# Altium schematic sheet 1.8寸脱机4轴-原理图-V2.0-2022.05.13.SchDoc
size A3
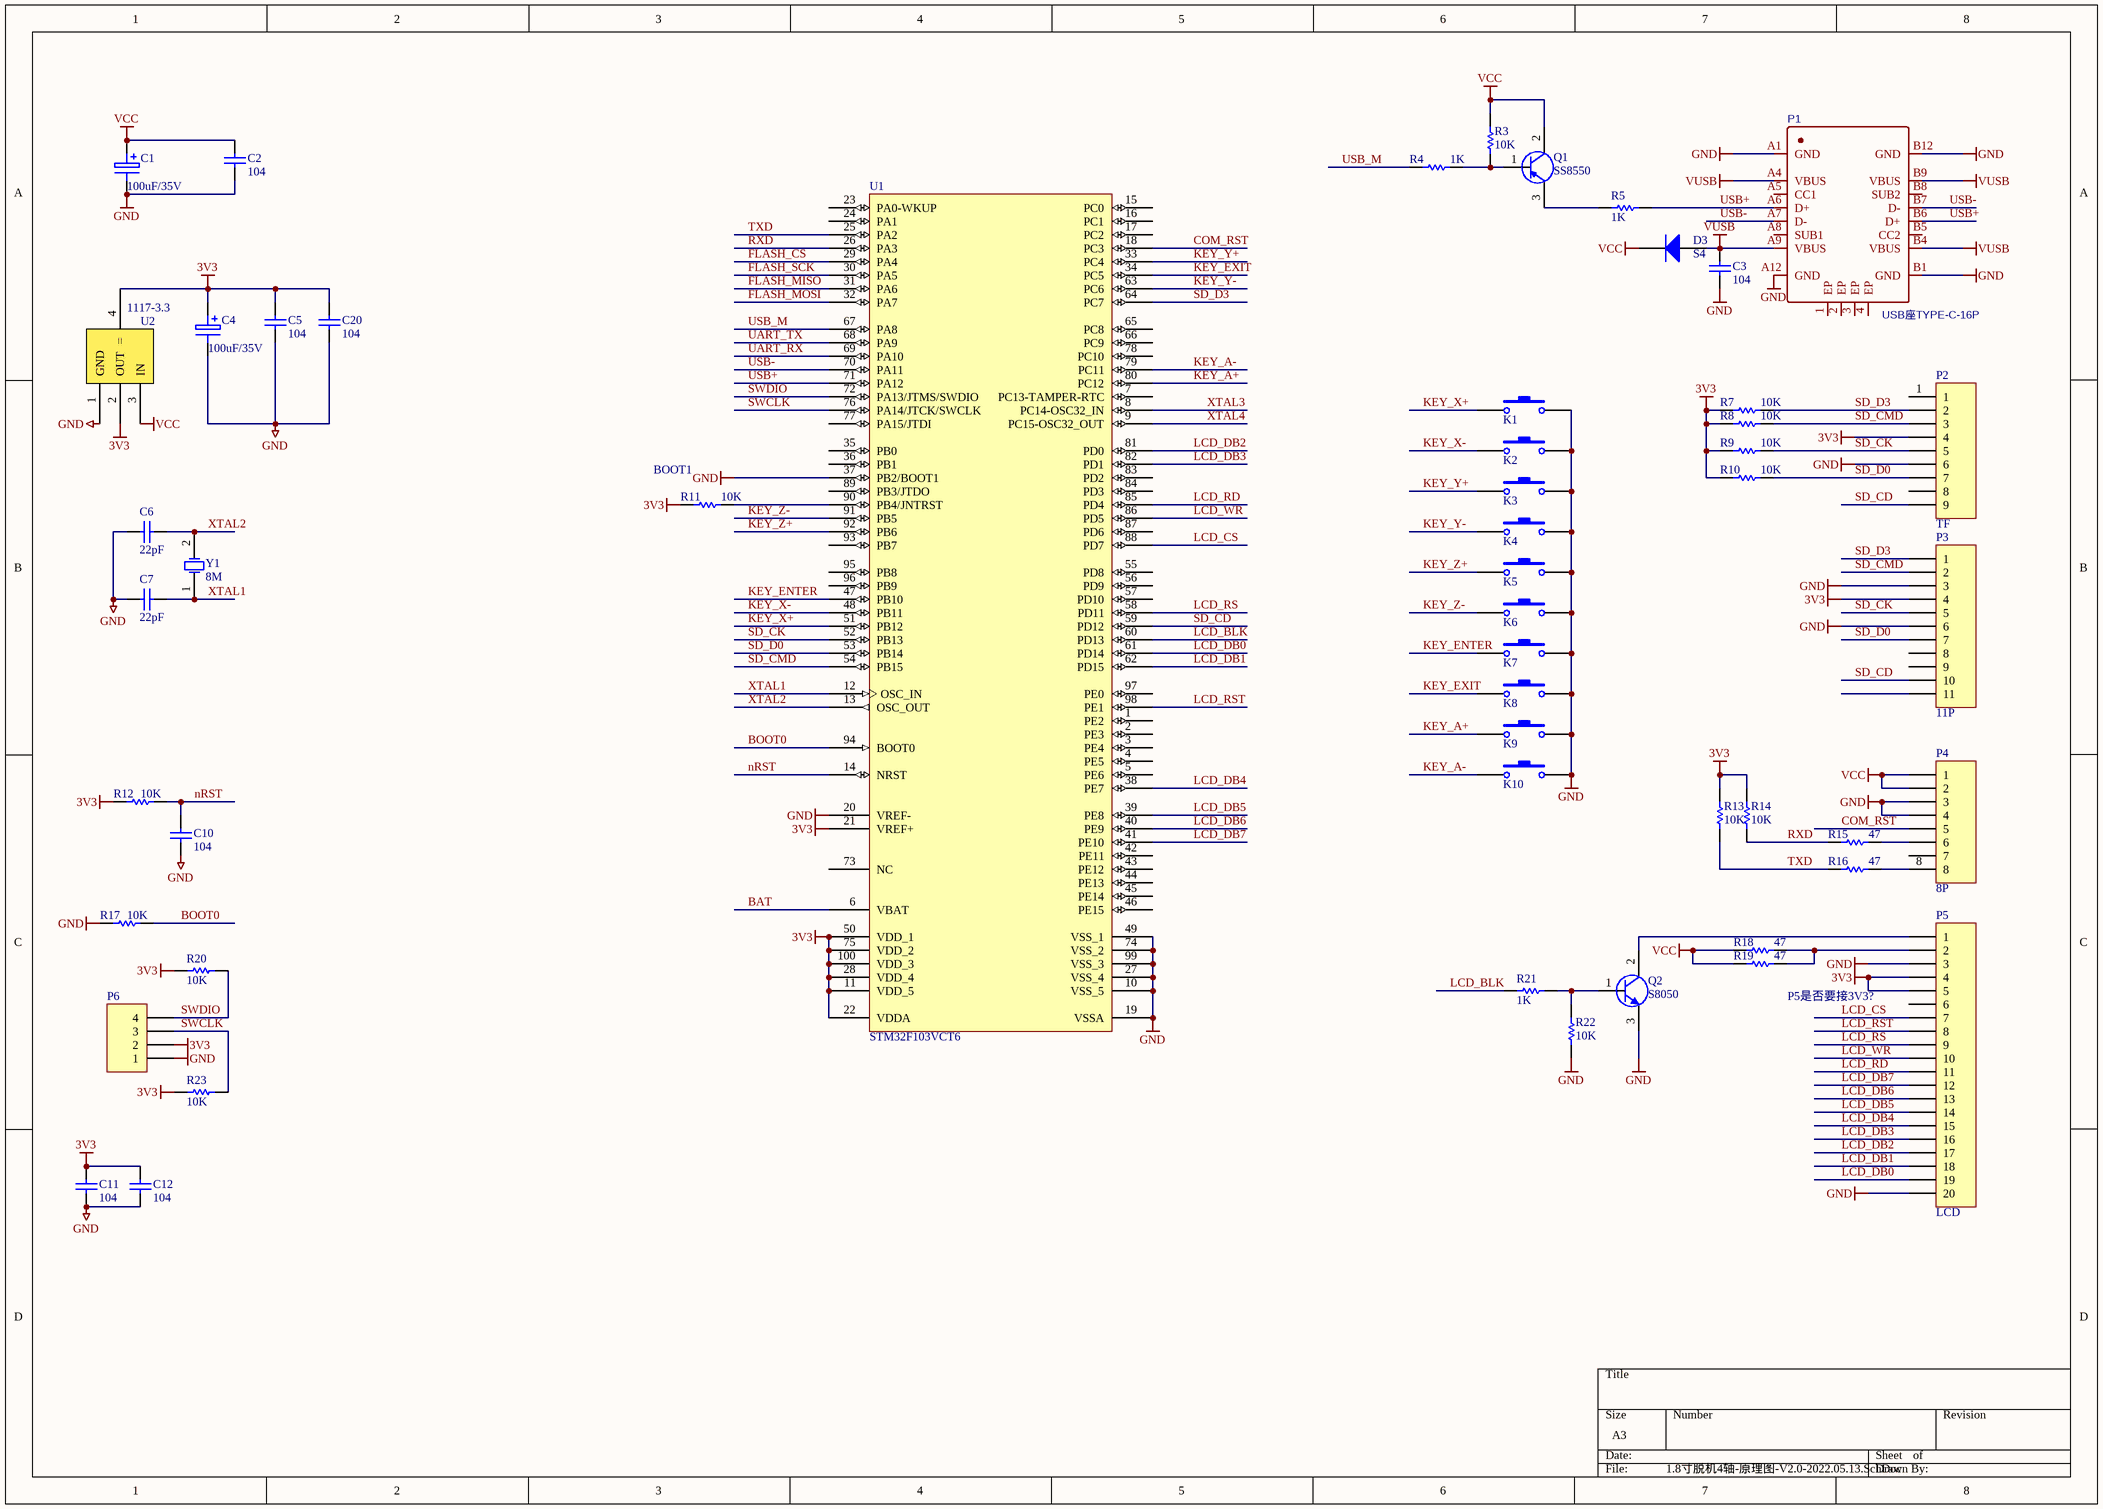
[diagram p0: 1.8寸脱机4轴-原理图-V2.0-2022.05.13.SchDoc]

## Parts
C1  100uF/35V  [电解电容贴片6x6]
C2  104  [0603C]
C3  104  [0603C]
C4  100uF/35V  [电解电容贴片6x6]
C5  104  [0603C]
C6  22pF  [0603C]
C7  22pF  [0603C]
C10  104  [0603C]
C11  104  [0603C]
C12  104  [0603C]
C20  value 104  [0603C]  (hidden comment: 106)
D3  S4  [SOD-123]
K1  (no value)  [按键6x6贴片]
K2  (no value)  [按键6x6贴片]
K3  (no value)  [按键6x6贴片]
K4  (no value)  [按键6x6贴片]
K5  (no value)  [按键6x6贴片]
K6  (no value)  [按键6x6贴片]
K7  (no value)  [按键6x6贴片]
K8  (no value)  [按键6x6贴片]
K9  (no value)  [按键6x6贴片]
K10  (no value)  [按键6x6贴片]
P1  USB座TYPE-C-16P  [USB-TYPE-C-16P-全贴片]
P2  TF  [TF卡自弹式]
P3  11P  [SD卡座自弹式]
P4  8P  [IDC8贴片]
P5  LCD  [显示屏1.77寸]
P6  (no value)  [SIP4]
Q1  SS8550  [SOT-23]
Q2  S8050  [SOT-23]
R3  10K  [0603R]
R4  1K  [0603R]
R5  1K  [0603R]
R7  10K  [0603R]
R8  10K  [0603R]
R9  10K  [0603R]
R10  10K  [0603R]
R11  10K  [0603R]
R12  10k  [0603R]
R13  10K  [0603R]
R14  10K  [0603R]
R15  47  [0603R]
R16  47  [0603R]
R17  10k  [0603R]
R18  47  [0603R]
R19  47  [0603R]
R20  10k  [0603R]
R21  1K  [0603R]
R22  10K  [0603R]
R23  10k  [0603R]
U1  STM32F103VCT6  [LQFP100]
U2  1117-3.3  [SOT-223]
Y1  8M  [晶振贴片]

## Nets
3V3: C4.1 C5.2 C11.2 C12.2 C20.2 P2.4 P3.4 P5.4 P5.5 P6.2 R7.1 R8.1 R9.1 R10.1 R11.1 R12.1 R13.2 R14.2 R20.2 R23.2 U1.11(VDD_5) U1.21(VREF+) U1.22(VDDA) U1.28(VDD_4) U1.50(VDD_1) U1.75(VDD_2) U1.100(VDD_3) U2.2(OUT) U2.4(=)
GND: C1.2 C2.1 C3.1 C4.2 C5.1 C6.2 C7.2 C10.1 C11.1 C12.1 C20.1 K1.2 K2.2 K3.2 K4.2 K5.2 K6.2 K7.2 K8.2 K9.2 K10.2 P1.A1(GND) P1.A12(GND) P1.B1(GND) P1.B12(GND) P2.6 P3.3 P3.6 P4.3 P4.4 P5.3 P5.20 P6.1 Q2.3(E) R17.1 R22.1 U1.10(VSS_5) U1.19(VSSA) U1.20(VREF-) U1.27(VSS_4) U1.37(PB2/BOOT1) U1.49(VSS_1) U1.74(VSS_2) U1.99(VSS_3) U2.1(GND)
VCC: C1.1 C2.2 D3.2 P4.1 P4.2 Q1.2(C) R3.1 R18.2 R19.2 U2.3(IN)
VUSB: C3.2 D3.1 P1.A4(VBUS) P1.A9(VBUS) P1.B4(VBUS) P1.B9(VBUS)
BAT: U1.6(VBAT)
BOOT0: R17.2 U1.94(BOOT0)
COM_RST: P4.5 U1.18(PC3)
FLASH_CS: U1.29(PA4)
FLASH_MISO: U1.31(PA6)
FLASH_MOSI: U1.32(PA7)
FLASH_SCK: U1.30(PA5)
KEY_A+: K9.1 U1.80(PC12)
KEY_A-: K10.1 U1.79(PC11)
KEY_ENTER: K7.1 U1.47(PB10)
KEY_EXIT: K8.1 U1.34(PC5)
KEY_X+: K1.1 U1.51(PB12)
KEY_X-: K2.1 U1.48(PB11)
KEY_Y+: K3.1 U1.33(PC4)
KEY_Y-: K4.1 U1.63(PC6)
KEY_Z+: K5.1 U1.92(PB6)
KEY_Z-: K6.1 U1.91(PB5)
LCD_BLK: R21.2 U1.60(PD13)
LCD_CS: P5.7 U1.88(PD7)
LCD_DB0: P5.19 U1.61(PD14)
LCD_DB1: P5.18 U1.62(PD15)
LCD_DB2: P5.17 U1.81(PD0)
LCD_DB3: P5.16 U1.82(PD1)
LCD_DB4: P5.15 U1.38(PE7)
LCD_DB5: P5.14 U1.39(PE8)
LCD_DB6: P5.13 U1.40(PE9)
LCD_DB7: P5.12 U1.41(PE10)
LCD_RD: P5.11 U1.85(PD4)
LCD_RS: P5.9 U1.58(PD11)
LCD_RST: P5.8 U1.98(PE1)
LCD_WR: P5.10 U1.86(PD5)
nRST: C10.2 R12.2 U1.14(NRST)
RXD: R14.1 R15.1 U1.26(PA3)
SD_CD: P2.9 P3.10 U1.59(PD12)
SD_CK: P2.5 P3.5 R9.2 U1.52(PB13)
SD_CMD: P2.3 P3.2 R8.2 U1.54(PB15)
SD_D0: P2.7 P3.7 R10.2 U1.53(PB14)
SD_D3: P2.2 P3.1 R7.2 U1.64(PC7)
SWCLK: P6.3 R23.1 U1.76(PA14/JTCK/SWCLK)
SWDIO: P6.4 R20.1 U1.72(PA13/JTMS/SWDIO)
TXD: R13.1 R16.1 U1.25(PA2)
UART_RX: U1.69(PA10)
UART_TX: U1.68(PA9)
USB+: P1.A6(D+) P1.B6(D+) R5.2 U1.71(PA12)
USB-: P1.A7(D-) P1.B7(D-) U1.70(PA11)
USB_M: R4.2 U1.67(PA8)
XTAL1: C7.1 U1.12(OSC_IN) Y1.1(OSC1)
XTAL2: C6.1 U1.13(OSC_OUT) Y1.2(OSC2)
XTAL3: U1.8(PC14-OSC32_IN)
XTAL4: U1.9(PC15-OSC32_OUT)
NetP4_6: P4.6 R15.2
NetP4_8: P4.8 R16.2
NetP5_1: P5.1 Q2.2(C)
NetP5_2: P5.2 R18.1 R19.1
NetQ1_1: Q1.1(B) R3.2 R4.1
NetQ1_3: Q1.3(E) R5.1
NetQ2_1: Q2.1(B) R21.1 R22.2
NetR11_2: R11.2 U1.90(PB4/JNTRST)

Not connected (* = marked no-connect by the designer): P1 1(EP) 2(EP) 3(EP) 4(EP) A5(CC1) A8(SUB1) B5(CC2) B8(SUB2); P2 1 8; P3 8 9 11; P4 7; P5 6; U1 1(PE2) 2(PE3) 3(PE4) 4(PE5) 5(PE6) 7(PC13-TAMPER-RTC) 15(PC0) 16(PC1) 17(PC2) 23(PA0-WKUP) 24(PA1) 35(PB0) 36(PB1) 42(PE11) 43(PE12) 44(PE13) 45(PE14) 46(PE15) 55(PD8) 56(PD9) 57(PD10) 65(PC8) 66(PC9) 73(NC) 77(PA15/JTDI) 78(PC10) 83(PD2) 84(PD3) 87(PD6) 89(PB3/JTDO) 93(PB7) 95(PB8) 96(PB9) 97(PE0)

## Notes on the sheet
- (near R11) BOOT1
- P5是否要接3V3?

## Library data of the parts
C1 C4 = ELECTRO1
C2 C3 C5 C10 C20 = Cap Semi: Capacitor (Semiconductor SIM Model); Published: 8-Jun-2000; LatestRevisionDate: 17-Jul-2002; LatestRevisionNote: Re-released for DXP Platform.; PackageReference: C1206; Publisher: Altium Limited
  C2 C3 C5 C10: Value: 104
C6 C7 = Cap Semi: Capacitor (Semiconductor SIM Model); Value: 18pF; Published: 8-Jun-2000; LatestRevisionDate: 17-Jul-2002; LatestRevisionNote: Re-released for DXP Platform.; PackageReference: C1206; Publisher: Altium Limited
C11 C12 = CAP: value: 104
D3 = 1N4148
K1-K10 = 按键
P1 = USB座TYPE-C-16P: BOM_Manufacturer: Shenzhen Kinghelm Elec; BOM_Manufacturer Part: KH-TYPE-C-16P-T; Contributor: LCSC; BOM_Supplier: LCSC; BOM_Supplier Part: C709358; spicePre: U; spiceSymbolName: KH-TYPE-C-16P-T
P2 = 9P
P5 = 20P
P6 = 4P
Q1 = PNP
Q2 = NPN: Published: 8-Jun-2000; LatestRevisionDate: 17-Jul-2002; LatestRevisionNote: Re-released for DXP Platform.; PackageReference: TO-226; Publisher: Altium Limited; Code_JEDEC: TO-226-AA
R3-R5 R7-R23 = RES: Resistor; Published: 8-Jun-2000; LatestRevisionDate: 17-Jul-2002; LatestRevisionNote: Re-released for DXP Platform.; PackageReference: AXIAL-0.3; Publisher: Altium Limited
  R12 R17 R20 R23: Value: 10K
U1 = STM32F103VBT6: STM32 ARM-based 32-bit MCU with 64 Kbytes Flash, 100-pin LQFP, Industrial Temperature; Published: *; DatasheetVersion: *; PackageVersion: *; PackageReference: *; Publisher: *; PackageDescription: *; ComponentLink1Description: *; ComponentLink1URL: *; ComponentLink2Description: *; ComponentLink2URL: *
U2 = LM1117
Y1 = XTAL: Crystal Oscillator; Published: 8-Jun-2000; LatestRevisionDate: 17-Jul-2002; LatestRevisionNote: Re-released for DXP Platform.; PackageReference: R38; Publisher: Altium Limited